# EAGLE schematic Precision Arduino Charlieplex 2.0 (EAGLE 6.91.2)
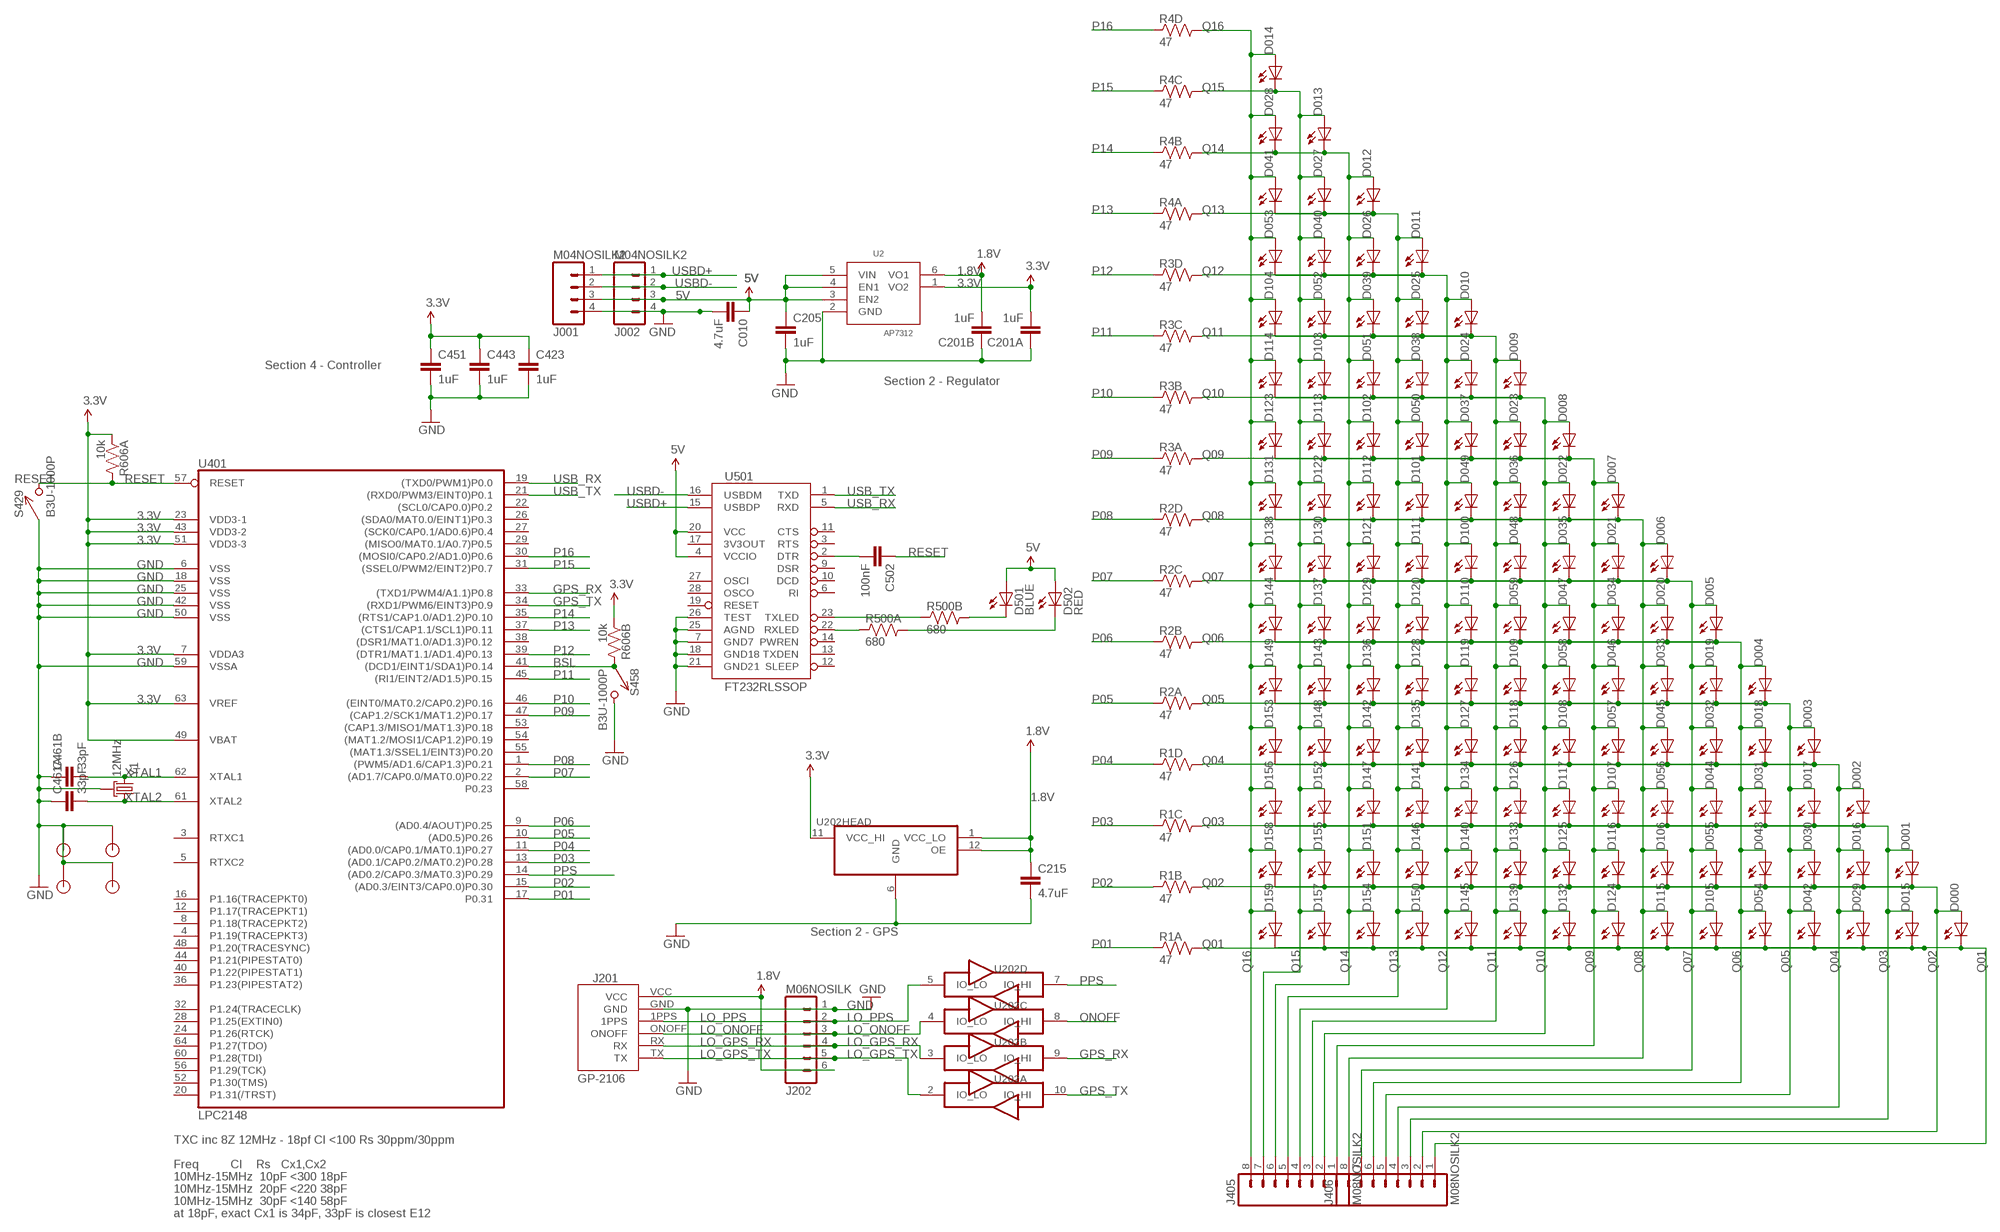
[diagram p0: schematic, sheet 1]

## Parts
C010  4.7uF  CAP0603-CAP  [0603-CAP]
C201  1uF  CKCM25  [CKCM25]
C205  1uF  CAP0603-CAP  [0603-CAP]
C215  4.7uF  CAP0402-CAP  [0402-CAP]
C423  1uF  CAP0603-CAP  [0603-CAP]
C443  1uF  CAP0603-CAP  [0603-CAP]
C451  1uF  CAP0603-CAP  [0603-CAP]
C461  33pF  CKCM25  [CKCM25]
C502  100nF  CAP0603-CAP  [0603-CAP]
D000  HOUR  LED0603  [LED-0603]
D001  HOUR  LED0603  [LED-0603]
D002  HOUR  LED0603  [LED-0603]
D003  HOUR  LED0603  [LED-0603]
D004  HOUR  LED0603  [LED-0603]
D005  HOUR  LED0603  [LED-0603]
D006  HOUR  LED0603  [LED-0603]
D007  HOUR  LED0603  [LED-0603]
D008  HOUR  LED0603  [LED-0603]
D009  HOUR  LED0603  [LED-0603]
D010  HOUR  LED0603  [LED-0603]
D011  HOUR  LED0603  [LED-0603]
D012  HOUR  LED0603  [LED-0603]
D013  HOUR  LED0603  [LED-0603]
D014  HOUR  LED0603  [LED-0603]
D015  HOUR  LED0603  [LED-0603]
D016  HOUR  LED0603  [LED-0603]
D017  HOUR  LED0603  [LED-0603]
D018  HOUR  LED0603  [LED-0603]
D019  HOUR  LED0603  [LED-0603]
D020  HOUR  LED0603  [LED-0603]
D021  HOUR  LED0603  [LED-0603]
D022  HOUR  LED0603  [LED-0603]
D023  HOUR  LED0603  [LED-0603]
D024  HOUR  LED0603  [LED-0603]
D025  HOUR  LED0603  [LED-0603]
D026  HOUR  LED0603  [LED-0603]
D027  HOUR  LED0603  [LED-0603]
D028  HOUR  LED0603  [LED-0603]
D029  HOUR  LED0603  [LED-0603]
D030  HOUR  LED0603  [LED-0603]
D031  HOUR  LED0603  [LED-0603]
D032  HOUR  LED0603  [LED-0603]
D033  HOUR  LED0603  [LED-0603]
D034  HOUR  LED0603  [LED-0603]
D035  HOUR  LED0603  [LED-0603]
D036  HOUR  LED0603  [LED-0603]
D037  HOUR  LED0603  [LED-0603]
D038  HOUR  LED0603  [LED-0603]
D039  HOUR  LED0603  [LED-0603]
D040  HOUR  LED0603  [LED-0603]
D041  HOUR  LED0603  [LED-0603]
D042  HOUR  LED0603  [LED-0603]
D043  HOUR  LED0603  [LED-0603]
D044  HOUR  LED0603  [LED-0603]
D045  HOUR  LED0603  [LED-0603]
D046  HOUR  LED0603  [LED-0603]
D047  HOUR  LED0603  [LED-0603]
D048  HOUR  LED0603  [LED-0603]
D049  HOUR  LED0603  [LED-0603]
D050  HOUR  LED0603  [LED-0603]
D051  HOUR  LED0603  [LED-0603]
D052  HOUR  LED0603  [LED-0603]
D053  HOUR  LED0603  [LED-0603]
D054  HOUR  LED0603  [LED-0603]
D055  HOUR  LED0603  [LED-0603]
D056  HOUR  LED0603  [LED-0603]
D057  HOUR  LED0603  [LED-0603]
D058  HOUR  LED0603  [LED-0603]
D059  HOUR  LED0603  [LED-0603]
D100  HOUR  LED0603  [LED-0603]
D101  HOUR  LED0603  [LED-0603]
D102  HOUR  LED0603  [LED-0603]
D103  HOUR  LED0603  [LED-0603]
D104  HOUR  LED0603  [LED-0603]
D105  HOUR  LED0603  [LED-0603]
D106  HOUR  LED0603  [LED-0603]
D107  HOUR  LED0603  [LED-0603]
D108  HOUR  LED0603  [LED-0603]
D109  HOUR  LED0603  [LED-0603]
D110  HOUR  LED0603  [LED-0603]
D111  HOUR  LED0603  [LED-0603]
D112  HOUR  LED0603  [LED-0603]
D113  HOUR  LED0603  [LED-0603]
D114  HOUR  LED0603  [LED-0603]
D115  HOUR  LED0603  [LED-0603]
D116  HOUR  LED0603  [LED-0603]
D117  HOUR  LED0603  [LED-0603]
D118  HOUR  LED0603  [LED-0603]
D119  HOUR  LED0603  [LED-0603]
D120  HOUR  LED0603  [LED-0603]
D121  HOUR  LED0603  [LED-0603]
D122  HOUR  LED0603  [LED-0603]
D123  HOUR  LED0603  [LED-0603]
D124  HOUR  LED0603  [LED-0603]
D125  HOUR  LED0603  [LED-0603]
D126  HOUR  LED0603  [LED-0603]
D127  HOUR  LED0603  [LED-0603]
D128  HOUR  LED0603  [LED-0603]
D129  HOUR  LED0603  [LED-0603]
D130  HOUR  LED0603  [LED-0603]
D131  HOUR  LED0603  [LED-0603]
D132  HOUR  LED0603  [LED-0603]
D133  HOUR  LED0603  [LED-0603]
D134  HOUR  LED0603  [LED-0603]
D135  HOUR  LED0603  [LED-0603]
D136  HOUR  LED0603  [LED-0603]
D137  HOUR  LED0603  [LED-0603]
D138  HOUR  LED0603  [LED-0603]
D139  HOUR  LED0603  [LED-0603]
D140  HOUR  LED0603  [LED-0603]
D141  HOUR  LED0603  [LED-0603]
D142  HOUR  LED0603  [LED-0603]
D143  HOUR  LED0603  [LED-0603]
D144  HOUR  LED0603  [LED-0603]
D145  HOUR  LED0603  [LED-0603]
D146  HOUR  LED0603  [LED-0603]
D147  HOUR  LED0603  [LED-0603]
D148  HOUR  LED0603  [LED-0603]
D149  HOUR  LED0603  [LED-0603]
D150  HOUR  LED0603  [LED-0603]
D151  HOUR  LED0603  [LED-0603]
D152  HOUR  LED0603  [LED-0603]
D153  HOUR  LED0603  [LED-0603]
D154  HOUR  LED0603  [LED-0603]
D155  HOUR  LED0603  [LED-0603]
D156  HOUR  LED0603  [LED-0603]
D157  HOUR  LED0603  [LED-0603]
D158  HOUR  LED0603  [LED-0603]
D159  HOUR  LED0603  [LED-0603]
D501  BLUE  LED0603  [LED-0603]
D502  RED  LED0603  [LED-0603]
J001  M04NOSILK2  [1X04]
J002  M04NOSILK2  [1X04]
J201  GP-2106  [GP-2106]
J202  M06NOSILK  [M06SIP]
J405  M08NOSILK2  [1X08]
J406  M08NOSILK2  [1X08]
JP1  STANDOFF  [STANDOFF]
JP2  STANDOFF  [STANDOFF]
JP3  STANDOFF  [STANDOFF]
JP4  STANDOFF  [STANDOFF]
R1  47  RP404  [CRA04]
R2  47  RP404  [CRA04]
R3  47  RP404  [CRA04]
R4  47  RP404  [CRA04]
R500  680  RP2EXB24V  [CRA02]
R606  10k  RP2EXB24V  [CRA02]
S429  B3U-1000P  [B3U-1000P]
S458  B3U-1000P  [B3U-1000P]
U2  AP7312  AP73X2  [SOT-23-6]
U202  TXB0104RUT  [R-PUQFN-N12]
U401  LPC2148  LPC213X  [SQFP-S-10X10-64]
U501  FT232RLSSOP  [SSOP28DB]
Y1  12MHz  CX2520  [CRYSTAL_SMD_2MM_2_5MM]

## Nets
1.8V: C201.3 C215.1 J201.VCC J202.6 U2.6(VO1) U202.1(HEAD:VCC_LO) U202.12(HEAD:OE)
3.3V [power]: C201.4 C423.1 C443.1 C451.1 R606.1 R606.2 U2.1(VO2) U202.11(HEAD:VCC_HI) U401.7(VDDA3) U401.23(VDD3-1) U401.43(VDD3-2) U401.49(VBAT) U401.51(VDD3-3) U401.63(VREF)
5V [power]: C010.1 C205.1 D501.A D502.A J001.3 J002.3 U2.3(EN2) U2.4(EN1) U2.5(VIN) U501.4(VCCIO) U501.20(VCC)
BSL: R606.3 S458.P$1 U401.41((DCD1/EINT1/SDA1)P0.14)
GND [power]: C010.2 C201.1 C201.2 C205.2 C215.2 C423.2 C443.2 C451.2 C461.1 C461.2 J001.4 J002.4 J201.GND J202.1 JP1.P$1 JP2.P$1 JP3.P$1 JP4.P$1 S429.P$1 S458.P$2 U2.2(GND) U202.6(HEAD:GND) U401.6(VSS) U401.18(VSS) U401.25(VSS) U401.42(VSS) U401.50(VSS) U401.59(VSSA) U501.7(GND7) U501.18(GND18) U501.21(GND21) U501.25(AGND) U501.26(TEST) Y1.2(GND) Y1.4(GND)
GPS_RX: U202.9(B:IO_HI) U401.33((TXD1/PWM4/A1.1)P0.8)
GPS_TX: U202.10(A:IO_HI) U401.34((RXD1/PWM6/EINT3)P0.9)
LO_GPS_RX: J201.RX J202.4 U202.3(B:IO_LO)
LO_GPS_TX: J201.TX J202.5 U202.2(A:IO_LO)
LO_ONOFF: J201.ONOFF J202.3 U202.4(C:IO_LO)
LO_PPS: J201.1PPS J202.2 U202.5(D:IO_LO)
ONOFF: U202.8(C:IO_HI)
P01: R1.1 U401.17(P0.31)
P02: R1.2 U401.15((AD0.3/EINT3/CAP0.0)P0.30)
P03: R1.3 U401.13((AD0.1/CAP0.2/MAT0.2)P0.28)
P04: R1.4 U401.11((AD0.0/CAP0.1/MAT0.1)P0.27)
P05: R2.1 U401.10((AD0.5)P0.26)
P06: R2.2 U401.9((AD0.4/AOUT)P0.25)
P07: R2.3 U401.2((AD1.7/CAP0.0/MAT0.0)P0.22)
P08: R2.4 U401.1((PWM5/AD1.6/CAP1.3)P0.21)
P09: R3.1 U401.47((CAP1.2/SCK1/MAT1.2)P0.17)
P10: R3.2 U401.46((EINT0/MAT0.2/CAP0.2)P0.16)
P11: R3.3 U401.45((RI1/EINT2/AD1.5)P0.15)
P12: R3.4 U401.39((DTR1/MAT1.1/AD1.4)P0.13)
P13: R4.1 U401.37((CTS1/CAP1.1/SCL1)P0.11)
P14: R4.2 U401.35((RTS1/CAP1.0/AD1.2)P0.10)
P15: R4.3 U401.31((SSEL0/PWM2/EINT2)P0.7)
P16: R4.4 U401.30((MOSI0/CAP0.2/AD1.0)P0.6)
PPS: U202.7(D:IO_HI) U401.14((AD0.2/CAP0.3/MAT0.3)P0.29)
Q01: D000.C D015.C D029.C D042.C D054.C D105.C D115.C D124.C D132.C D139.C D145.C D150.C D154.C D157.C D159.C J406.1 R1.8
Q02: D000.A D001.C D016.C D030.C D043.C D055.C D106.C D116.C D125.C D133.C D140.C D146.C D151.C D155.C D158.C J406.2 R1.7
Q03: D001.A D002.C D015.A D017.C D031.C D044.C D056.C D107.C D117.C D126.C D134.C D141.C D147.C D152.C D156.C J406.3 R1.6
Q04: D002.A D003.C D016.A D018.C D029.A D032.C D045.C D057.C D108.C D118.C D127.C D135.C D142.C D148.C D153.C J406.4 R1.5
Q05: D003.A D004.C D017.A D019.C D030.A D033.C D042.A D046.C D058.C D109.C D119.C D128.C D136.C D143.C D149.C J406.5 R2.8
Q06: D004.A D005.C D018.A D020.C D031.A D034.C D043.A D047.C D054.A D059.C D110.C D120.C D129.C D137.C D144.C J406.6 R2.7
Q07: D005.A D006.C D019.A D021.C D032.A D035.C D044.A D048.C D055.A D100.C D105.A D111.C D121.C D130.C D138.C J406.7 R2.6
Q08: D006.A D007.C D020.A D022.C D033.A D036.C D045.A D049.C D056.A D101.C D106.A D112.C D115.A D122.C D131.C J406.8 R2.5
Q09: D007.A D008.C D021.A D023.C D034.A D037.C D046.A D050.C D057.A D102.C D107.A D113.C D116.A D123.C D124.A J405.1 R3.8
Q10: D008.A D009.C D022.A D024.C D035.A D038.C D047.A D051.C D058.A D103.C D108.A D114.C D117.A D125.A D132.A J405.2 R3.7
Q11: D009.A D010.C D023.A D025.C D036.A D039.C D048.A D052.C D059.A D104.C D109.A D118.A D126.A D133.A D139.A J405.3 R3.6
Q12: D010.A D011.C D024.A D026.C D037.A D040.C D049.A D053.C D100.A D110.A D119.A D127.A D134.A D140.A D145.A J405.4 R3.5
Q13: D011.A D012.C D025.A D027.C D038.A D041.C D050.A D101.A D111.A D120.A D128.A D135.A D141.A D146.A D150.A J405.5 R4.8
Q14: D012.A D013.C D026.A D028.C D039.A D051.A D102.A D112.A D121.A D129.A D136.A D142.A D147.A D151.A D154.A J405.6 R4.7
Q15: D013.A D014.C D027.A D040.A D052.A D103.A D113.A D122.A D130.A D137.A D143.A D148.A D152.A D155.A D157.A J405.7 R4.6
Q16: D014.A D028.A D041.A D053.A D104.A D114.A D123.A D131.A D138.A D144.A D149.A D153.A D156.A D158.A D159.A J405.8 R4.5
RESET: C502.1 R606.4 S429.P$2 U401.57(RESET)
RESET_FT: C502.2 U501.2(DTR)
RXLED: D502.C R500.4
RXLED_FT: R500.1 U501.22(RXLED)
TXLED: D501.C R500.3
TXLED_FT: R500.2 U501.23(TXLED)
USB_RX: U401.19((TXD0/PWM1)P0.0) U501.5(RXD)
USB_TX: U401.21((RXD0/PWM3/EINT0)P0.1) U501.1(TXD)
USBD+: J001.1 J002.1 U501.15(USBDP)
USBD-: J001.2 J002.2 U501.16(USBDM)
XTAL1: C461.3 U401.62(XTAL1) Y1.3
XTAL2: C461.4 U401.61(XTAL2) Y1.1
Unconnected: U401.3(RTXC1) U401.4(P1.19(TRACEPKT3)) U401.5(RTXC2) U401.8(P1.18(TRACEPKT2)) U401.12(P1.17(TRACEPKT1)) U401.16(P1.16(TRACEPKT0)) U401.20(P1.31(/TRST)) U401.22((SCL0/CAP0.0)P0.2) U401.24(P1.26(RTCK)) U401.26((SDA0/MAT0.0/EINT1)P0.3) U401.27((SCK0/CAP0.1/AD0.6)P0.4) U401.28(P1.25(EXTIN0)) U401.29((MISO0/MAT0.1/A0.7)P0.5) U401.32(P1.24(TRACECLK)) U401.36(P1.23(PIPESTAT2)) U401.38((DSR1/MAT1.0/AD1.3)P0.12) U401.40(P1.22(PIPESTAT1)) U401.44(P1.21(PIPESTAT0)) U401.48(P1.20(TRACESYNC)) U401.52(P1.30(TMS)) U401.53((CAP1.3/MISO1/MAT1.3)P0.18) U401.54((MAT1.2/MOSI1/CAP1.2)P0.19) U401.55((MAT1.3/SSEL1/EINT3)P0.20) U401.56(P1.29(TCK)) U401.58(P0.23) U401.60(P1.28(TDI)) U401.64(P1.27(TDO)) U501.3(RTS) U501.6(RI) U501.9(DSR) U501.10(DCD) U501.11(CTS) U501.12(SLEEP) U501.13(TXDEN) U501.14(PWREN) U501.17(3V3OUT) U501.19(RESET) U501.27(OSCI) U501.28(OSCO)

## Notes on the sheet
- Section 4 - Controller
- Section 2 - Regulator
- Section 2 - GPS
- TXC inc 8Z 12MHz - 18pf Cl <100 Rs 30ppm/30ppm
- Freq         Cl    Rs   Cx1,Cx2
- 10MHz-15MHz  10pF <300 18pF
- 10MHz-15MHz  20pF <220 38pF
- 10MHz-15MHz  30pF <140 58pF
- at 18pF, exact Cx1 is 34pF, 33pF is closest E12

## Library data of the parts
C010 C502 = SparkFun:CAP: Capacitor Standard 0603 ceramic capacitor, and 0.1" leaded capacitor.
C201 C461 = KwanSystems:CKC
C205 C423 C451 = SparkFun-Capacitors:CAP: Capacitor Standard 0603 ceramic capacitor, and 0.1" leaded capacitor.; DIGIKEY: 445-4114-1-ND
C215 = SparkFun:CAP: Capacitor Standard 0603 ceramic capacitor, and 0.1" leaded capacitor.; DIGIKEY: 445-7395-1-ND
C443 = SparkFun-Capacitors:CAP: Capacitor Standard 0603 ceramic capacitor, and 0.1" leaded capacitor.; DIGIKEY: 445-1265-1-ND
D000 D001-D009 D010-D059 D100-D159 D501 D502 = SparkFun:LED: LEDs Standard schematic elements and footprints for 5mm, 3mm, 1206, and 0603 sized LEDs. 5mm - Spark Fun Electronics SKU : COM-00529 (and others)
J001 J002 = KwanSystems:M04
J201 = SparkFun:GP-2106: GP-2106 GPS SiRF IV
J202 = KwanSystems:M06
J405 J406 = KwanSystems:M08
JP1-JP4 = KwanSystems:STANDOFF
R1-R4 = KwanSystems:RP4
R500 R606 = KwanSystems:RP2
S429 = KwanSystems:B3U-1000P
S458 = KwanSystems:B3U-1000P; DIGIKEY: SW1020CT-ND
U2 = KwanSystems:AP73X2: Dual 300mA LDO Regulator http://www.diodes.com/datasheets/AP7332.pdf
U202 = KwanSystems:TXB0104
U401 = SparkFun:LPC213X: LPC213x Schematic element and footprint for NXP LPC213x. Spark Fun Electronics SKU : COM-00520; DIGIKEY: 568-1765-ND
U501 = SparkFun:FT232RL: USB UART FT232RL 4th Generation USB UART (USB <-> Serial) Controller. Spark Fun Electronics SKU : COM-00650
Y1 = KwanSystems:CX2520; DIGIKEY: 887-1487-1-ND

## Net classes
0 default: width 0.152 mm, drill 0.33 mm, clearance 0.152 mm
1 power: width 0.152 mm, drill 0.33 mm, clearance 0.152 mm to class 0, clearance 0.152 mm